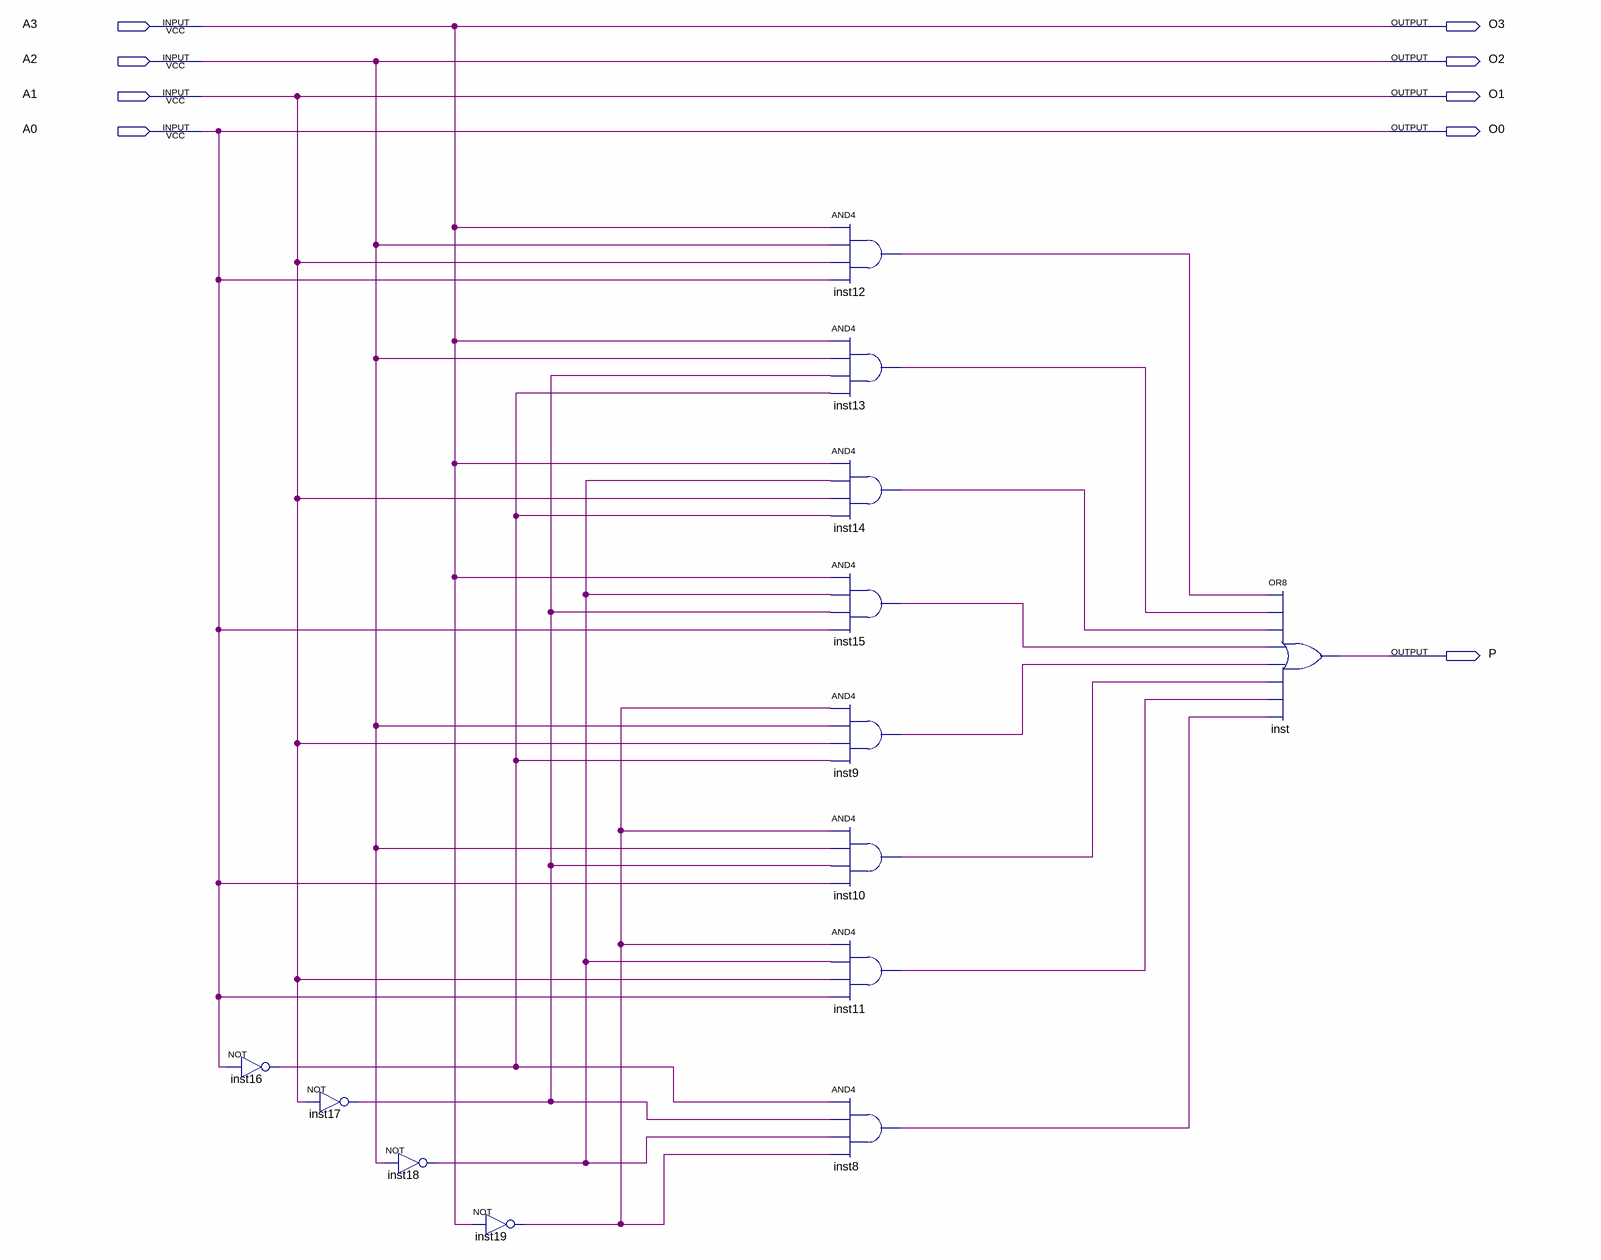
[diagram p0: schematic sheet]
// Quartus schematic cse345_project.bdf as structural Verilog: 13 symbols, 9 pins
module cse345_project (
  input  A3,
  input  A2,
  input  A1,
  input  A0,
  output O3,
  output O2,
  output O1,
  output O0,
  output P
);

  wire inst8_out, inst9_out, inst10_out, inst11_out, inst12_out, inst13_out, inst14_out, inst15_out,
       inst16_out, inst17_out, inst18_out, inst19_out;

  not inst16 (inst16_out, A0);
  not inst17 (inst17_out, A1);
  not inst18 (inst18_out, A2);
  not inst19 (inst19_out, A3);
  and inst12 (inst12_out, A3, A2, A1, A0);
  and inst13 (inst13_out, A3, A2, inst17_out, inst16_out);
  and inst14 (inst14_out, A3, inst18_out, A1, inst16_out);
  and inst15 (inst15_out, A3, inst18_out, inst17_out, A0);
  and inst9 (inst9_out, inst19_out, A2, A1, inst16_out);
  and inst10 (inst10_out, inst19_out, A2, inst17_out, A0);
  and inst11 (inst11_out, inst19_out, inst18_out, A1, A0);
  and inst8 (inst8_out, inst16_out, inst17_out, inst18_out, inst19_out);
  or inst (P, inst12_out, inst13_out, inst14_out, inst15_out, inst9_out, inst10_out, inst11_out, inst8_out);

  assign O0 = A0;
  assign O1 = A1;
  assign O2 = A2;
  assign O3 = A3;
endmodule
